# EAGLE design picaxe_adapter (EAGLE 7.5.0)
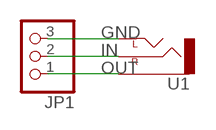
[diagram p0: schematic, sheet 1]

## Parts
JP1  PINHD-1X3  [1X03]
U1  AUDIO-JACKPTH  [AUDIO-JACK]

## Nets
GND [GND]: JP1.3 U1.TIP(LEFT)
IN: JP1.2 U1.RING(RIGHT)
OUT: JP1.1 U1.SLEEVE

## Library data of the parts
JP1 = pinhead:PINHD-1X3: PIN HEADER
U1 = SparkFun-Connectors:AUDIO-JACK: 3.5mm Audio Jack Simple 3.5mm common PCB mount audio jack. SKU: PRT-08032

## Net classes
0 default: width 0.508 mm
1 GND: width 0.889 mm, drill 0.508 mm, clearance 0.254 mm
2 VCC: width 0.889 mm, drill 0.508 mm, clearance 0.254 mm

## Board
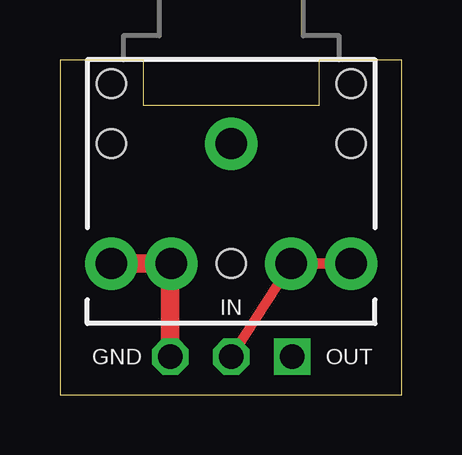
[diagram p1: board, top side]
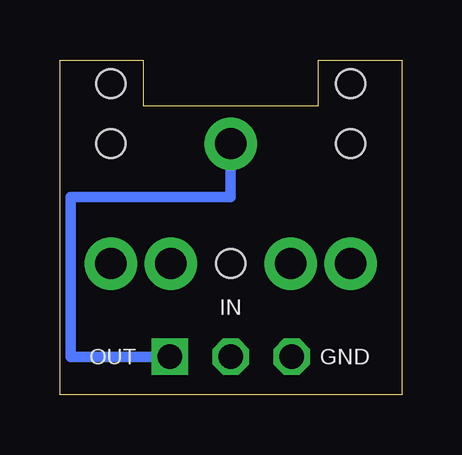
[diagram p2: board, bottom side, seen from below]

Size 14.27 x 13.97 mm. Coordinates in mm from the lower left corner, seen from the top.
Outline: 0,0 14.27,0 14.27,13.96 10.79,13.97 10.79,12.06 3.49,12.06 3.49,13.96 0,13.96 0,0
Copper layers (1*16): Top 0.035mm / dielectric 1.5mm / Bottom 0.035mm
Design rules "default": minimum track width 10mil, minimum drill 24mil, track to track 8mil, track to pad 8mil, pad to pad 8mil, via to via 8mil, smd to smd 8mil, copper to edge 40mil, drill to drill 8mil, minimum pad ring 10mil, minimum via ring 8mil, stop-mask expansion 4mil, vias tented up to drill 0mil, thermal gap 10mil

### Footprints (pad centres in the part's own frame; a part is rotated, then mirrored left to right if it is on the bottom)
1X03 = drill 1.016 square: 1 -2.54,0 | drill 1.016 octagon: 2 0,0; 3 2.54,0
AUDIO-JACK = drill 1.3 pad 2.184: RING 5,5; RSH 5,2.5; SLEEVE 0,0; TIP 5,-5; TSH 5,-2.5 | hole 1.2: 0,5; -2.5,5; -2.5,-5; 0,-5; 5,0

### Placement (x,y rotation side)
JP1  7.14,1.59 180 top
U1  7.14,10.48 270 top

### Tracks (layer width: path | path; a pad name or v marks a point on that pad's centre or on a via)
GND
  Top 0.762: U1.TIP 4.52,5.48 4.6,5.4 JP1.3
IN
  Top 0.432: U1.RING 9.68,5.48 9.21,4.76 JP1.2
OUT
  Bottom 0.432: JP1.1 13.81,1.59 13.81,8.25 7.14,8.25 U1.SLEEVE

### Text on the board
tNames: IN | GND | OUT
bNames: IN | GND | OUT